# EAGLE design counter (EAGLE 6.6.0)
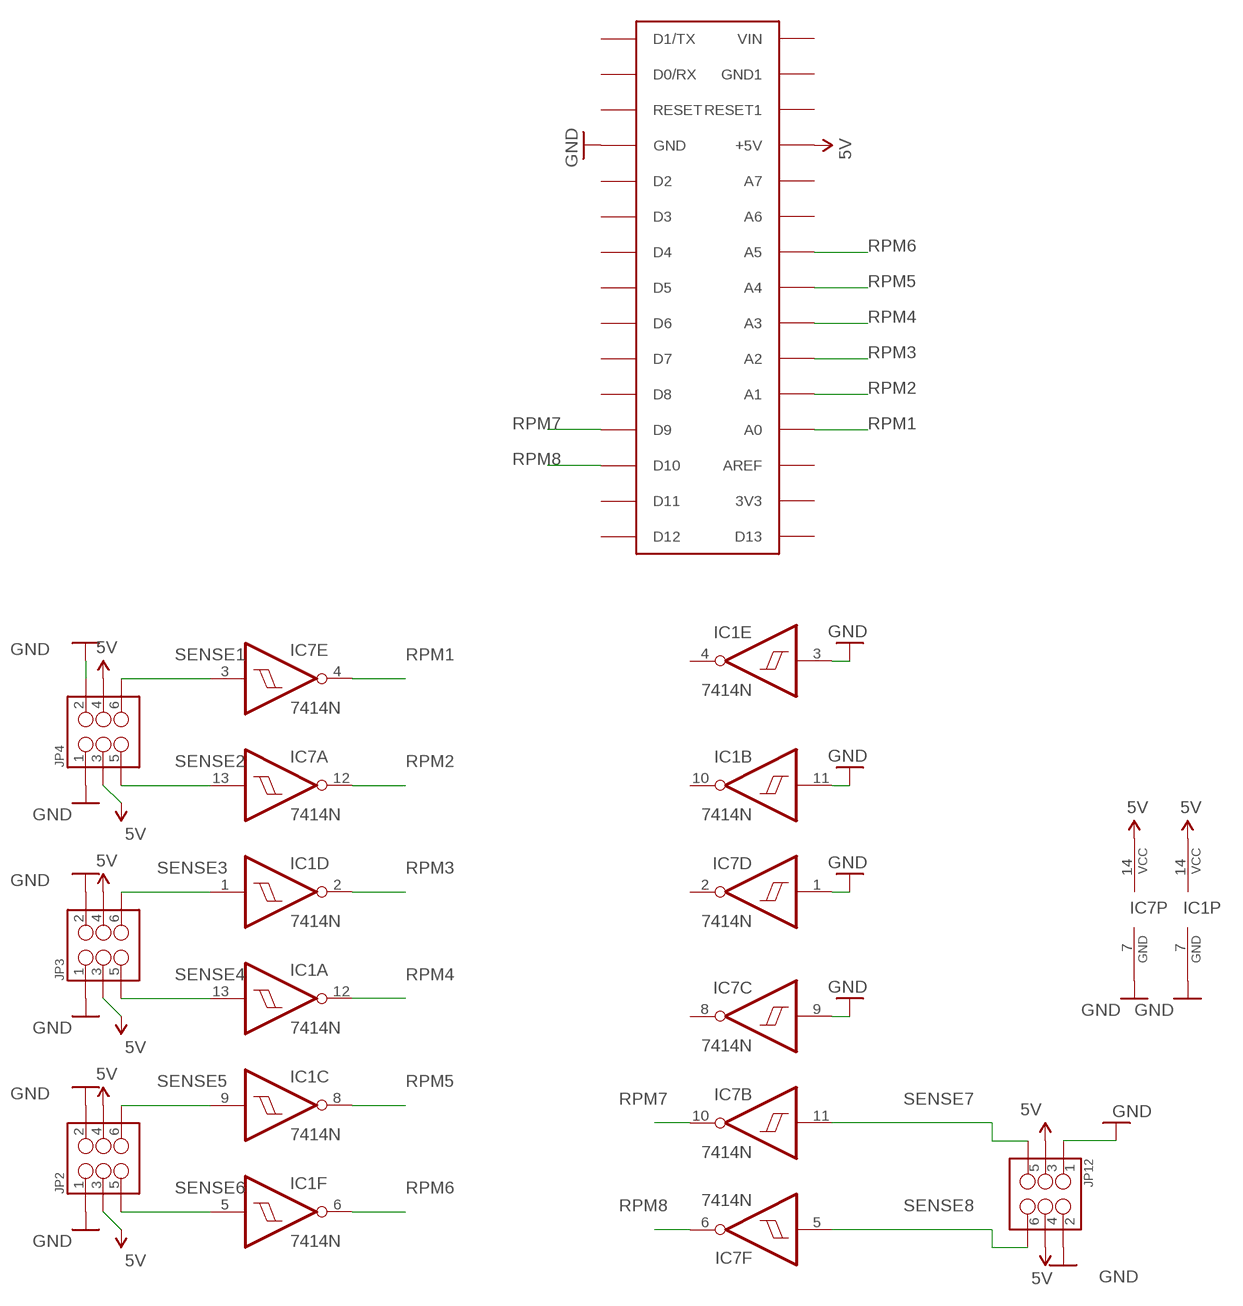
[diagram p0: schematic, sheet 1]

## Parts
IC1  7414N  [DIL14]
IC7  7414N  [DIL14]
JP2  M03X2NO_SILK  [2X3-NS]
JP3  M03X2NO_SILK  [2X3-NS]
JP4  M03X2NO_SILK  [2X3-NS]
JP12  M03X2NO_SILK  [2X3-NS]
U$1  ARDUINONANO  [PDIP-32]

## Nets
5V: IC1.14(P:VCC) IC7.14(P:VCC) JP2.3 JP2.4 JP3.3 JP3.4 JP4.3 JP4.4 JP12.3 JP12.4 U$1.+5V
GND: IC1.3(E:I) IC1.7(P:GND) IC1.11(B:I) IC7.1(D:I) IC7.7(P:GND) IC7.9(C:I) JP2.1 JP2.2 JP3.1 JP3.2 JP4.1 JP4.2 JP12.1 JP12.2 U$1.GND
RPM1: IC7.4(E:O) U$1.A0
RPM2: IC7.12(A:O) U$1.A1
RPM3: IC1.2(D:O) U$1.A2
RPM4: IC1.12(A:O) U$1.A3
RPM5: IC1.8(C:O) U$1.A4
RPM6: IC1.6(F:O) U$1.A5
RPM7: IC7.10(B:O) U$1.D9
RPM8: IC7.6(F:O) U$1.D10
SENSE1: IC7.3(E:I) JP4.6
SENSE2: IC7.13(A:I) JP4.5
SENSE3: IC1.1(D:I) JP3.6
SENSE4: IC1.13(A:I) JP3.5
SENSE5: IC1.9(C:I) JP2.6
SENSE6: IC1.5(F:I) JP2.5
SENSE7: IC7.11(B:I) JP12.5
SENSE8: IC7.5(F:I) JP12.6
Unconnected: IC1.4(E:O) IC1.10(B:O) IC7.2(D:O) IC7.8(C:O) U$1.3V3 U$1.A6 U$1.A7 U$1.AREF U$1.D0/RX U$1.D1/TX U$1.D2 U$1.D3 U$1.D4 U$1.D5 U$1.D6 U$1.D7 U$1.D8 U$1.D11 U$1.D12 U$1.D13 U$1.GND1 U$1.RESET U$1.RESET1 U$1.VIN

## Library data of the parts
IC1 IC7 = 74xx-us:74*14: Hex schmitt trigger INVERTER
JP2-JP4 JP12 = SparkFun-Connectors:M03X2: 2x3 .1" header. Shrouded, with keying- CONN-10681 SMT- CONN-11415 Pogo pins- HW-11044
U$1 = jet-lib:ARDUINONANO

## Net classes
0 default: clearance 0.205 mm

## Board
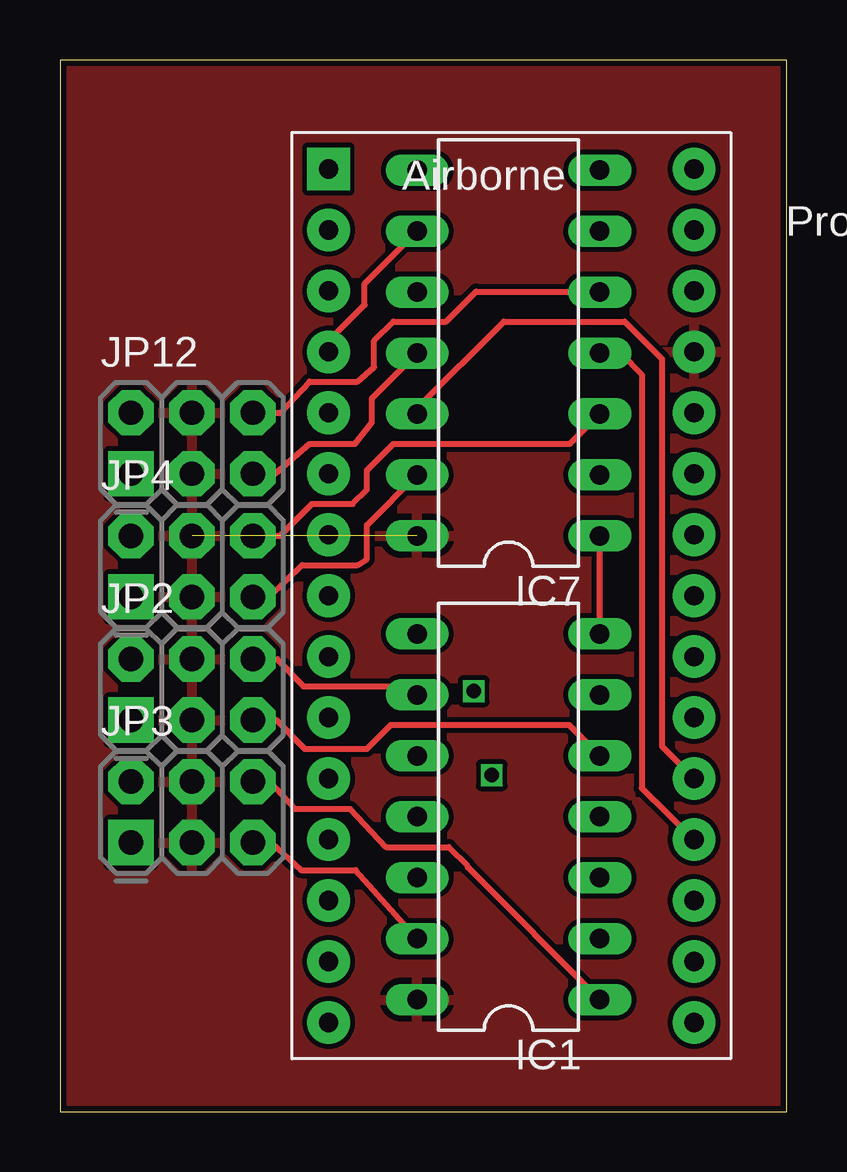
[diagram p1: board, top side]
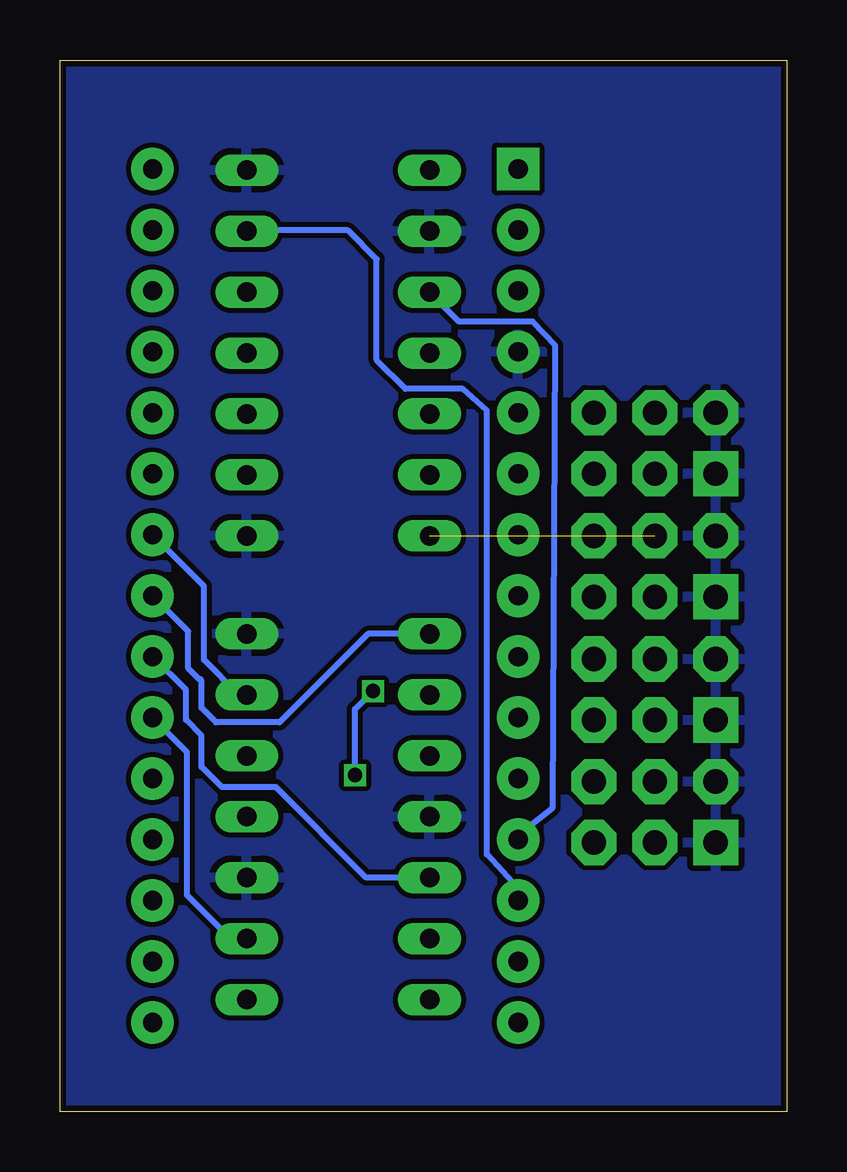
[diagram p2: board, bottom side, seen from below]

Size 30.3 x 43.82 mm. Coordinates in mm from the lower left corner, seen from the top.
Outline: 0,0 30.3,0 30.3,43.82 0,43.82 0,0
Copper layers (1*16): Top 0.035mm / dielectric 1.5mm / Bottom 0.035mm
Design rules "SeeedStudio_2layer_DRU_no_angle_20140221": minimum track width 6mil, minimum drill 12mil, track to track 6mil, track to pad 6mil, pad to pad 6mil, via to via 6mil, smd to smd 0mil, copper to edge 10mil, drill to drill 10mil, minimum pad ring 10mil, minimum via ring 6mil, stop-mask expansion 2mil, vias tented up to drill 100mil, thermal gap 10mil

### Footprints (pad centres in the part's own frame; a part is rotated, then mirrored left to right if it is on the bottom)
DIL14 = drill 0.813 long: 1 -7.62,-3.81; 2 -5.08,-3.81; 3 -2.54,-3.81; 4 0,-3.81; 5 2.54,-3.81; 6 5.08,-3.81; 7 7.62,-3.81; 8 7.62,3.81; 9 5.08,3.81; 10 2.54,3.81; 11 0,3.81; 12 -2.54,3.81; 13 -5.08,3.81; 14 -7.62,3.81
2X3-NS = drill 1.016 pad 1.88 square: 1 -2.54,-1.27 | drill 1.016 pad 1.88 octagon: 2 -2.54,1.27; 3 0,-1.27; 4 0,1.27; 5 2.54,-1.27; 6 2.54,1.27
PDIP-32 = drill 0.8 pad 1.778: 3V3 15.24,-35.56; +5V 15.24,-10.16; A0 15.24,-30.48; A1 15.24,-27.94; A2 15.24,-25.4; A3 15.24,-22.86; A4 15.24,-20.32; A5 15.24,-17.78; A6 15.24,-15.24; A7 15.24,-12.7; AREF 15.24,-33.02; D0/RX 0,-5.08; D2 0,-12.7; D3 0,-15.24; D4 0,-17.78; D5 0,-20.32; D6 0,-22.86; D7 0,-25.4; D8 0,-27.94; D9 0,-30.48; D10 0,-33.02; D11 0,-35.56; D12 0,-38.1; D13 15.24,-38.1; GND 0,-10.16; GND1 15.24,-5.08; RESET 0,-7.62; RESET1 15.24,-7.62; VIN 15.24,-2.54 | drill 0.8 pad 1.778 square: D1/TX 0,-2.54

### Placement (x,y rotation side)
IC1  18.7,12.29 90 top
IC7  18.7,31.61 90 top
JP2  5.5,17.59 0 top
JP3  5.5,12.48 0 top
JP4  5.5,22.72 0 top
JP12  5.5,27.85 0 top
U$1  11.2,41.82 0 top

### Tracks (layer width: path | path; a pad name or v marks a point on that pad's centre or on a via)
5V  (1 unrouted)
  pour Top: -1.7,44.43 -2,-1 31.2,-1 31.5,44.43
+5V  (via drill 0.6)
  Bottom 0.254: v18,14.02 18,16.77 v17.25,17.52
GND
  Top 0.254: IC1.7 IC7.1 | U$1.GND 11.2,32.12 12.7,33.62 12.7,34.5 IC7.9
  pour Bottom: -3,-1 31.2,-1 31.2,46.73 -3.6,46.73
RPM1
  Top 0.254: IC7.4 23.41,31.61 24.25,30.72 24.25,13.48 U$1.A0
RPM2
  Top 0.254: IC7.12 14.89,29.31 18.5,32.92 23.55,32.92 25.1,31.37 25.1,15.22 U$1.A1
RPM3
  Bottom 0.254: IC1.2 23.19,7.21 25,9.02 25,14.98 U$1.A2
RPM4
  Bottom 0.254: IC1.12 17.53,9.75 21.3,13.52 23.55,13.52 24.4,14.37 24.4,15.67 25.05,16.32 25.05,17.57 U$1.A3
RPM5
  Bottom 0.254: IC1.8 17.46,19.91 21.15,16.22 23.8,16.22 24.4,16.82 24.4,17.97 24.45,18.02 24.5,18.02 24.95,18.47 24.95,20.01 U$1.A4
RPM6
  Bottom 0.254: IC1.6 22.85,17.37 24.3,18.82 24.3,21.9 U$1.A5
RPM7
  Bottom 0.254: U$1.D9 11.2,11.52 9.75,12.67 9.65,31.92 10.6,32.92 13.66,32.92 IC7.10
RPM8
  Bottom 0.254: U$1.D10 11.2,9.32 12.5,10.72 12.5,29.22 13.5,30.12 15.9,30.12 17.1,31.32 17.1,35.52 18.3,36.72 22.48,36.72 IC7.6
SENSE1
  Top 0.254: JP4.6 9.17,23.99 10.5,25.32 12.2,25.32 12.8,25.92 12.8,26.72 13.9,27.82 21.26,27.82 IC7.3
SENSE2
  Top 0.254: JP4.5 8.73,21.45 10.1,22.77 12.4,22.77 12.8,23.02 12.8,24.44 IC7.13
SENSE3
  Top 0.254: JP3.6 8.77,13.75 9.8,12.62 12.1,12.62 13.6,11.02 16.2,11.02 17,10.22 17,10.18 IC1.1
SENSE4
  Top 0.254: JP3.5 8.8,11.21 10.05,10.07 12.33,10.07 IC1.13
SENSE5
  Top 0.254: JP2.6 9.06,18.86 10.15,17.72 14.64,17.72 IC1.9
SENSE6
  Top 0.254: JP2.5 9,16.32 10.2,15.12 12.8,15.12 13.8,16.12 21.22,16.12 IC1.5
SENSE7
  Top 0.254: JP12.5 8.96,26.58 10.4,27.82 12.3,27.82 13,28.72 13,29.72 IC7.11
SENSE8
  Top 0.254: JP12.6 9.2,29.12 10.4,30.42 12.4,30.42 13.1,31.02 13.1,32.12 13.9,32.92 16.1,32.92 17.35,34.17 22.49,34.17 IC7.5